# Altium schematic sheet DP_UART_CH340G.SchDoc
size A4
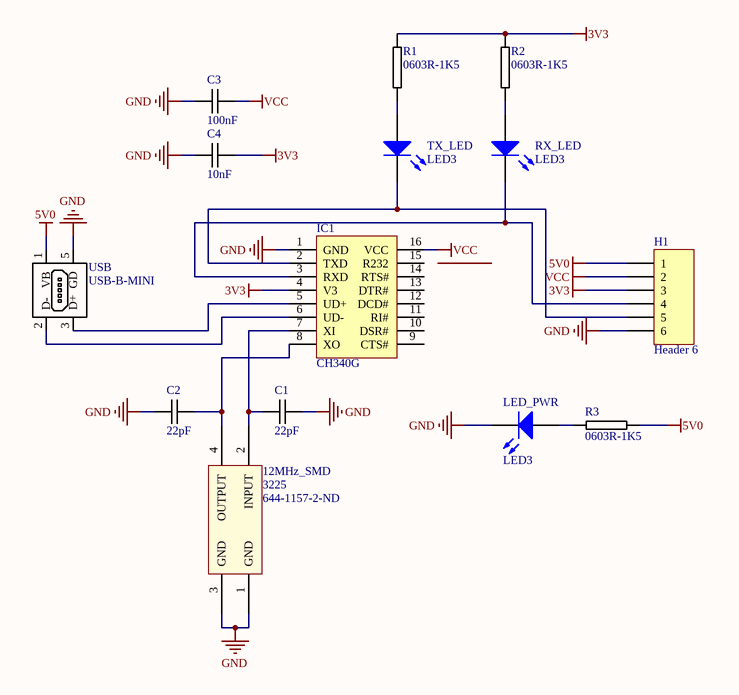
[diagram p0: DP_UART_CH340G.SchDoc]

## Parts
12MHz_SMD  3225  Supplier Part Number 1: 644-1157-2-ND  [XTAL 3225]
C1  22pF  [0603C-GENERIC]
C2  22pF  [0603C-GENERIC]
C3  100nF  [0603C-GENERIC]
C4  10nF  [0603C-GENERIC]
H1  Header 6  [HDR1X6]
IC1  CH340G  [SO16]
LED_PWR  LED3  [3.5X2.8X1.9]
R1  0603R-1K5  [0603R-1k5]
R2  0603R-1K5  [0603R-1k5]
R3  0603R-1K5  [0603R-1k5]
RX_LED  LED3  [3.5X2.8X1.9]
TX_LED  LED3  [3.5X2.8X1.9]
USB  USB-B-MINI  [USB-MINI-B]

## Nets
3V3: C4.2 H1.3 IC1.4(V3) R1.1 R2.1
5V0: H1.1 R3.1 USB.1(VB)
GND: 12MHz_SMD.1(GND) 12MHz_SMD.3(GND) C1.2 C2.1 C3.1 C4.1 H1.6 IC1.1(GND) LED_PWR.2(K) USB.5(GD)
VCC: C3.2 H1.2 IC1.16(VCC)
Net12MHz_SMD_2: 12MHz_SMD.2(INPUT) C1.1 IC1.7(XI)
Net12MHz_SMD_4: 12MHz_SMD.4(OUTPUT) C2.2 IC1.8(XO)
NetH1_4: H1.4 IC1.3(RXD) RX_LED.2(K)
NetH1_5: H1.5 IC1.2(TXD) TX_LED.2(K)
NetIC1_5: IC1.5(UD+) USB.3(D+)
NetIC1_6: IC1.6(UD-) USB.2(D-)
NetLED_PWR_1: LED_PWR.1(A) R3.2
NetR1_2: R1.2 TX_LED.1(A)
NetR2_2: R2.2 RX_LED.1(A)

Not connected (* = marked no-connect by the designer): IC1 9(CTS#) 10(DSR#) 11(RI#) 12(DCD#) 13(DTR#) 14(RTS#) 15(R232)

## Library data of the parts
12MHz_SMD = 3225 Quartz: Supplier 1: Digi-Key
C1 C2 = Passives_Capacitors_0603_22PF-50V-C0G-PAN: CAPACITOR 0603 CERAMIC; Manufacturer Part Number: ECJ-1VC1H220J; Manufacturer: Panasonic - ECG; Reel: C10; Tolerance: ±5%; Temperature Coefficient: C0G, NP0; Voltage - Rated: 50V; Supplier 1: Digi-Key; Features: General Purpose; Lead Spacing: -; Supplier: Digi-Key; Capacitance: 22pF; Packaging: Tape & Reel (TR); Mounting Type: Surface Mount, MLCC; RoHS: RoHS Compliant; Operating Temperature: -55°C ~ 125°C; Thickness: 0.80mm; Package / Case: 0603 (1608 metric); Category: Capacitors; Supplier Part Number 1: PCC220ACVTR-ND; Supplier Part Number: PCC220ACVTR-ND
C3 = Passives_Capacitors_0603_100NF-25V-X7R-TDK: CAPACITOR 0603 CERAMIC; Manufacturer Part Number: C1608X7R1E104K; Manufacturer: TDK Corporation; Reel: C12; Supplier 1: Digi-Key; Supplier Part Number 1: 445-1316-2-ND
C4 = Passives_Capacitors_0603_10NF-50V-X7R-MUR: CAPACITOR 0603 CERAMIC; Manufacturer Part Number: GRM188R71H103KA01D; Manufacturer: Murata Electronics North America; Reel: C22; Supplier 1: Digi-Key; Supplier Part Number 1: 490-1512-2-ND
H1 = Header 6: Header, 6-Pin; LatestRevisionDate: 17-Jul-2002; LatestRevisionNote: Re-released for DXP Platform.; Publisher: Altium Limited
LED_PWR RX_LED TX_LED = LED3: Typical BLUE SiC LED; Published: 8-Jun-2000; LatestRevisionDate: 17-Dec-2003; LatestRevisionNote: PCB Footprint replaced.; DatasheetVersion: 16-Apr-2002; PackageVersion: 16-Apr-2002; PackageReference: 3.5X2.8X1.9; Publisher: Altium Limited; PackageDescription: SM LED; 2 C-Bend Leads; Body 3.5 x 2.8 x 1.9 mm, inc leads (LxWxH typ)
R1-R3 = 0603R-1K5: GENERIC RESISTOR 0603; Manufacturer Part Number: RMCF 1/16 15K 1% R; Manufacturer: Stackpole Electronics Inc; Tolerance: ±1%; Resistance In Ohms: 15.0K; Power (Watts): 0.1W, 1/10W; Temperature Coefficient: ±100ppm/°C; Supplier 1: Digi-Key; Supplier Part Number 1: RMCF1/1615KFRTR-ND; Supplier: Digi-Key; Supplier Part Number: RMCF1/1615KFRTR-ND; Packaging: Tape & Reel (TR); Category: Resistors; Case: 0603 (1608 metric); Composition: Thick Film; Lead Style: Surface Mount (SMD - SMT); RoHS: RoHS Compliant
USB = Connector_USB_THT_USB-B-MINI: MINI USB B DEVICE CONNECTOR